# EasyEDA Pro project DC电路板.eprj

# Schematic Schematic1
Create Date: 2023-11-20; Page Name: P1; Project Name: DC电路板; Schematic Name: Schematic1; Update Date: 2023-11-20; Company: 嘉立创EDA; Page Size: A4; Version: V1.0
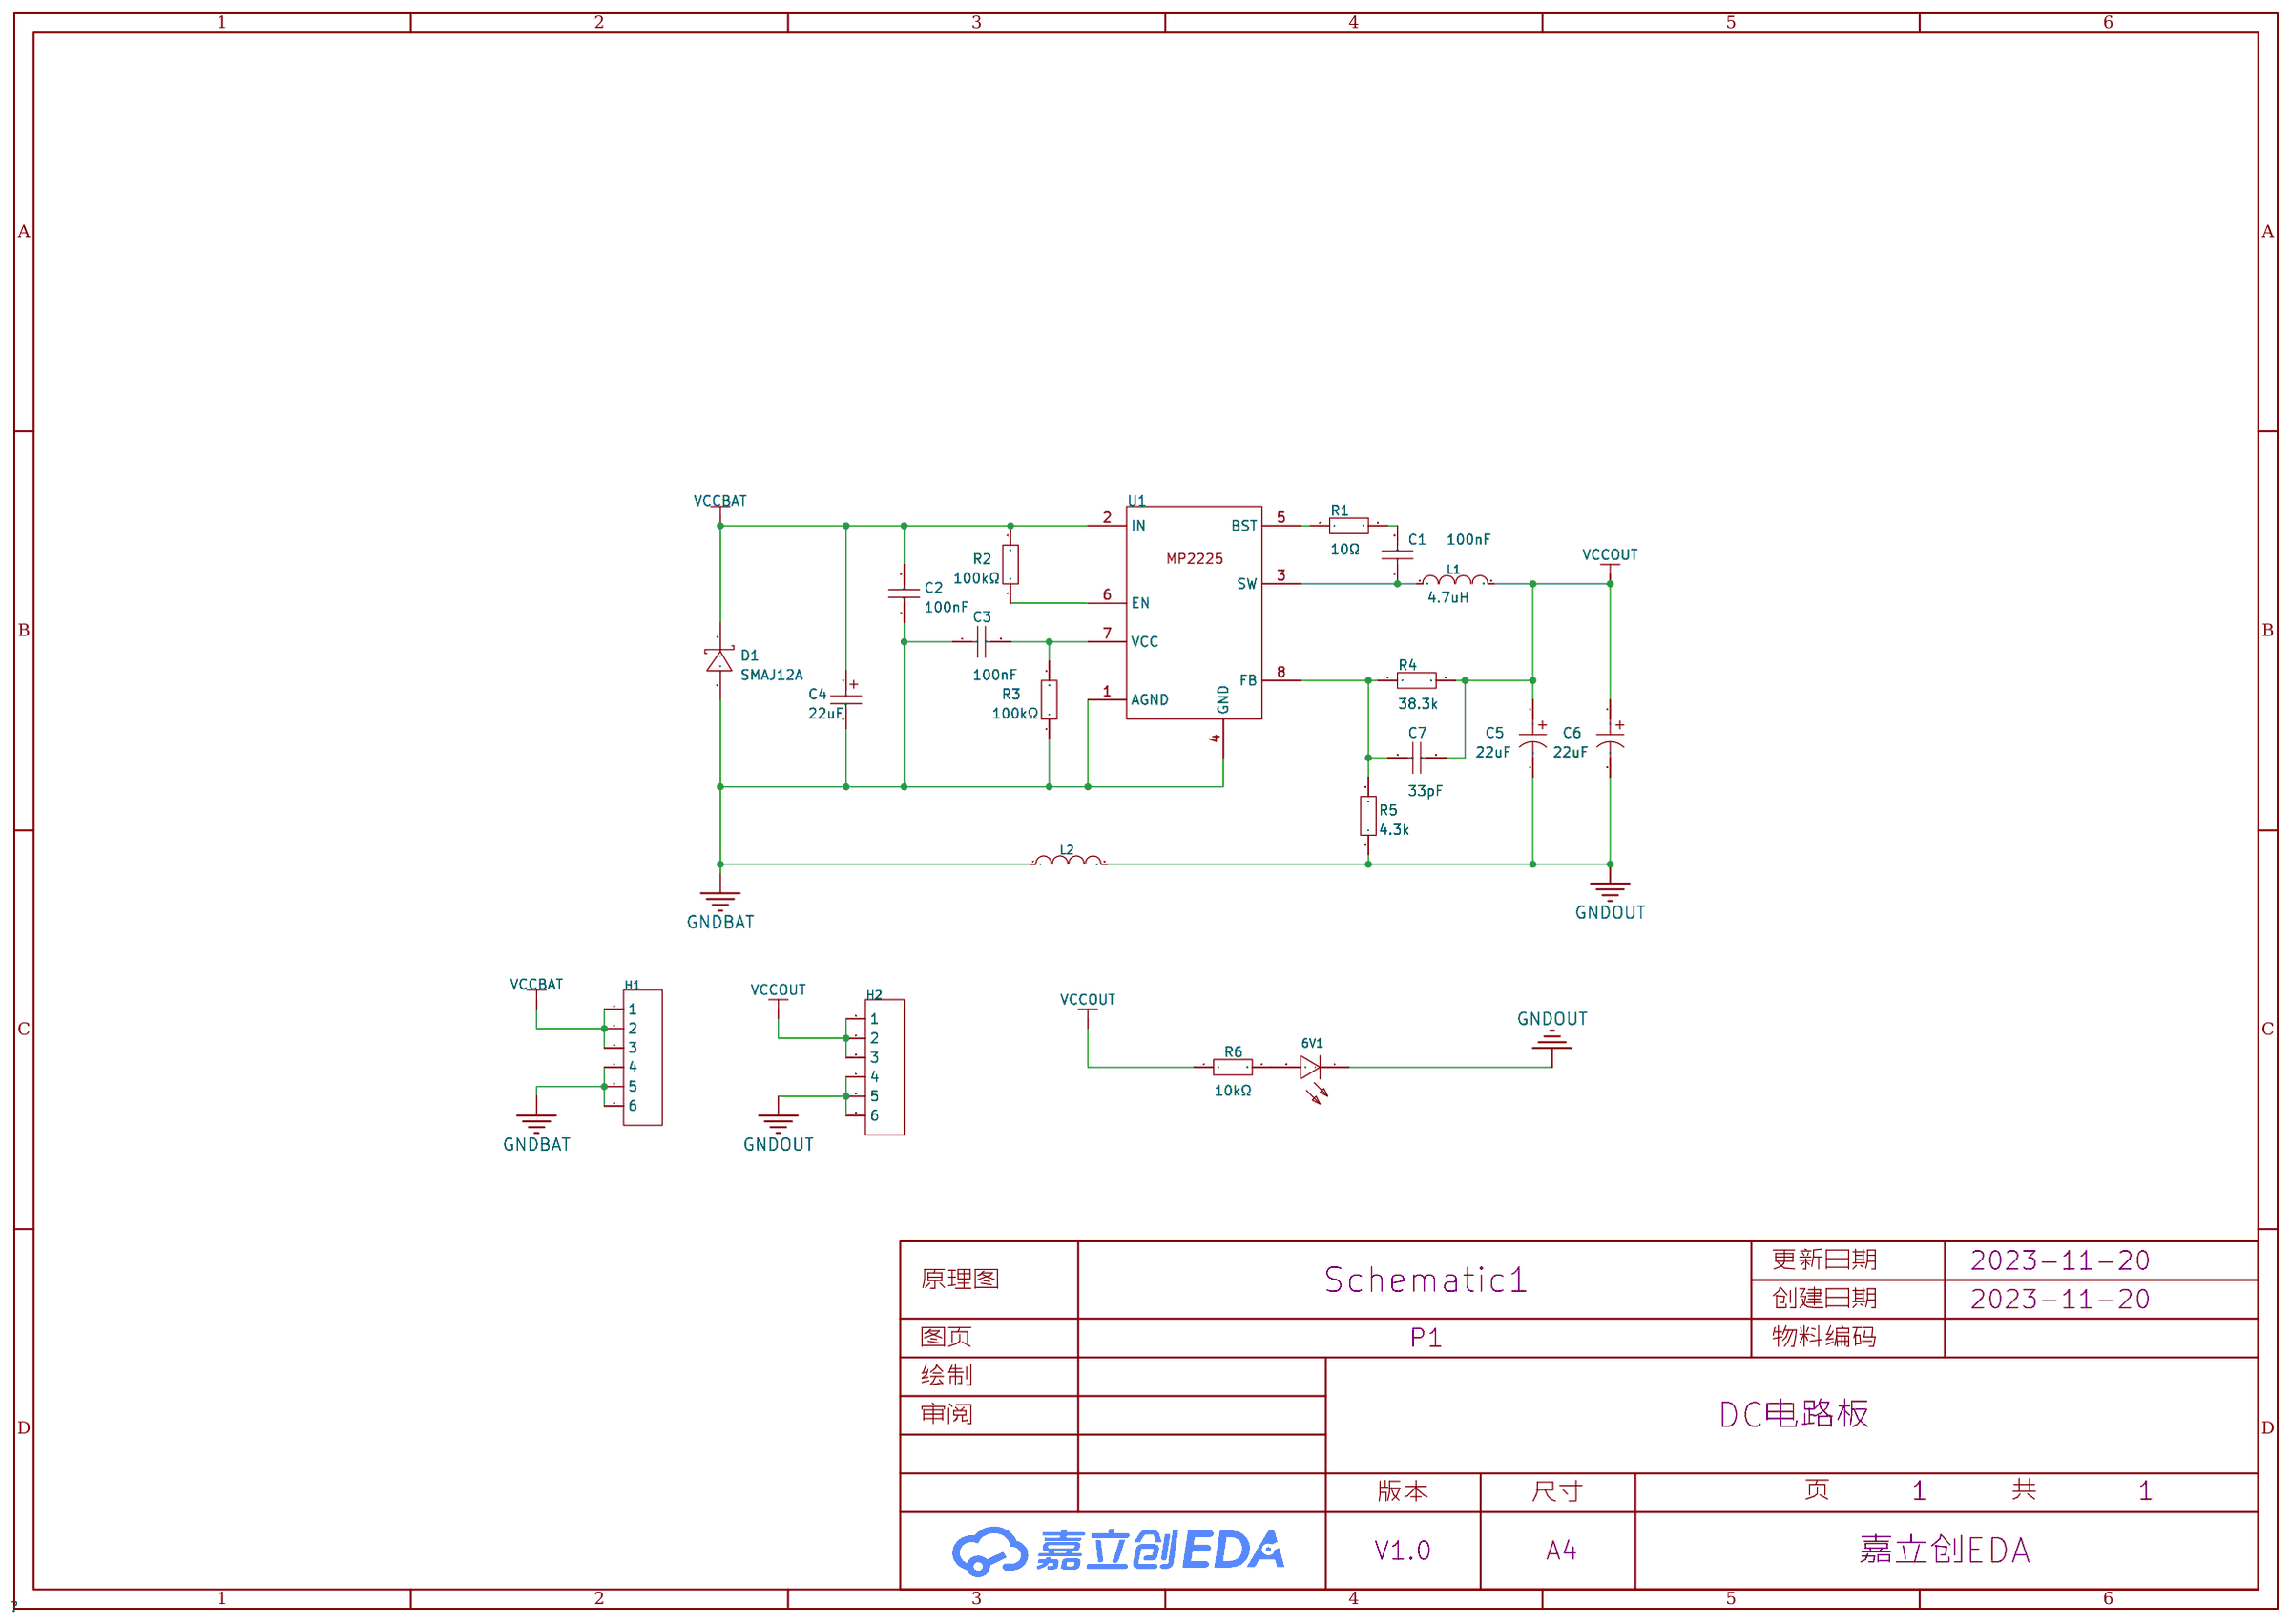
[diagram p0: schematic sheet]

## Parts
6V1  NCD0603W1  [LED0603-RD]
C1  100nF  [C0603]
C2  100nF  [C0603]
C3  100nF  [C0603]
C4  22uF  [CAP-SMD_L6.0-W3.2-R-RD]
C5  22uF  [CAP-SMD_L3.2-W1.6]
C6  22uF  [CAP-SMD_L3.2-W1.6]
C7  33pF  [C0603]
D1  SMAJ12A  [SMA_L4.4-W2.7-LS5.1-RD]
H1  -  [HDR-TH_6P-P2.54-V-M-1]
H2  -  [HDR-TH_6P-P2.54-V-M-1]
L1  4.7uH  [IND-SMD_L5.4-W5.2_FXL0530]
L2  CBG201209U000T  [L0805]
R1  10Ω  [R0603]
R2  100kΩ  [R0603]
R3  100kΩ  [R0603]
R4  38.3k  [R0603]
R5  4.3k  [R0603]
R6  10kΩ  [R0603]
U1  -  [tsot-23-8_l2.9-w1.6-p0.65-ls2.8-br]

## Library data of the parts
6V1 = NCD0603W1: 发光颜色:白灯;; LCSC Part Name: 白灯 0603白灯   正贴; Supplier Part: C84265; Manufacturer: 国星光电; Supplier Footprint: 0603; JLCPCB Part Class: Extended Part; Datasheet: https://atta.szlcsc.com/upload/public/pdf/source/20200820/C84265_479E6193713348A548E5CD6D9278BF16.pdf; Supplier: LCSC; Emitted Color: 白灯
C1-C3 = 0603B104K500NT: 容值:100nF;精度:±10%;额定电压:50V;材质(温度系数):X7R;; LCSC Part Name: 100nF ±10% 50V; Supplier Part: C30926; Manufacturer: FH(风华); Supplier Footprint: 0603; JLCPCB Part Class: Extended Part; Datasheet: https://atta.szlcsc.com/upload/public/pdf/source/20170923/C30926_1506149436298988724.pdf; Supplier: LCSC; Tolerance: ±10%; Voltage Rated: 50V; Temperature Coefficient: X7R
C4 = TAJC226K025RNJ: 容值:22uF;精度:±10%;额定电压:25V;等效串联电阻:1.4Ω@100kHz;; LCSC Part Name: 22uF ±10% 25V; Supplier Part: C7214; Manufacturer: Kyocera AVX; Supplier Footprint: CASE-C-6032; JLCPCB Part Class: Extended Part; Datasheet: https://atta.szlcsc.com/upload/public/pdf/source/20160107/1457707749198.pdf; Supplier: LCSC; Tolerance: ±10%; Rated Voltage: 25V; Equivalent Series Resistance(ESR): 1.4Ω@100kHz; Operating Temperature: -55℃~+125℃
C5 C6 = CA45-A-16V-22uF-K: 容值:22uF;精度:±10%;额定电压:16V;等效串联电阻:6Ω@100kHz;; LCSC Part Name: 22uF ±10% 16V; Supplier Part: C782264; Manufacturer: CEC(振华新云); Supplier Footprint: CASE-A-3216; JLCPCB Part Class: Extended Part; Datasheet: https://atta.szlcsc.com/upload/public/pdf/source/20200909/C782264_D6D9C4EF3B25E81633C26A9294FBB820.pdf; Supplier: LCSC; Tolerance: ±10%; Rated Voltage: 16V; Equivalent Series Resistance(ESR): 6Ω@100kHz; Operating Temperature: -55℃~+125℃
C7 = CL10C330JB8NNNC: 容值:33pF;精度:±5%;额定电压:50V;材质(温度系数):C0G;; LCSC Part Name: 33pF ±5% 50V; Supplier Part: C1663; Manufacturer: SAMSUNG(三星); Supplier Footprint: 0603; JLCPCB Part Class: 基础库; Datasheet: https://atta.szlcsc.com/upload/public/pdf/source/20160103/1457707688366.pdf; Supplier: LCSC; Tolerance: ±5%; Voltage Rated: 50V; Temperature Coefficient: C0G
D1 = SMAJ12A_C152123: 极性:单向;反向截止电压(Vrwm):12V;击穿电压:13.3V;峰值脉冲电流(Ipp)@10/1000μs:20.1A;最大钳位电压:19.9V;; LCSC Part Name: 单向 Vrwm:12V; Supplier Part: C152123; Manufacturer: BORN(伯恩半导体); Supplier Footprint: SMA(DO-214AC); JLCPCB Part Class: 扩展库; Datasheet: https://atta.szlcsc.com/upload/public/pdf/source/20181205/C152123_F062F647BF686681D55A64EEC7CBEC59.pdf; Supplier: LCSC; Polarity: 单向; Reverse Stand-Off Voltage (Vrwm): 12V; Breakdown Voltage: 13.3V; Peak Pulse Current (Ipp)@10/1000μs: 20.1A; Maximum Clamping Voltage: 19.9V
H1 H2 = HDR-M_2.54_1x6P: Supplier Part: C37208; Supplier Footprint: 插件
L1 = FXL0530-4R7-M: 电感值:4.7uH;精度:±20%;额定电流:4.5A;饱和电流(Isat):5A;; LCSC Part Name: 4.7uH ±20% 4.5A 50mΩ; Supplier Part: C177246; Manufacturer: cjiang(长江微电); Supplier Footprint: SMD,5.4x5.2x2.8mm; JLCPCB Part Class: Extended Part; Supplier: LCSC; Tolerance: ±20%; Rated Current: 4.5A; Saturation Current (Isat): 5A; DC Resistance (DCR): 50mΩ
L2 = CBG201209U000T: 标称阻抗@测试频率:0Ω@100MHz;直流电阻(RDC):80mΩ;; LCSC Part Name: 单路 0805磁珠 阻抗0Ω@100MHz; Supplier Part: C91037; Manufacturer: FH(风华); Supplier Footprint: 0805; JLCPCB Part Class: 扩展库; Datasheet: https://atta.szlcsc.com/upload/public/pdf/source/20161217/1481939213023.pdf; Supplier: LCSC; Impedance @ Frequency: 0Ω@100MHz; DC Resistance: 80mΩ; Current Rating: 900mA; Circuits: 1
R1 = 0603WAF100JT5E: 电阻类型:厚膜电阻;阻值:10Ω;精度:±1%;功率:100mW;; LCSC Part Name: 10Ω ±1% 100mW; Supplier Part: C22859; Manufacturer: UNI-ROYAL(厚声); Supplier Footprint: 0603; JLCPCB Part Class: Basic Part; Datasheet: https://atta.szlcsc.com/upload/public/pdf/source/20200306/C422600_1E6D84923E4A46A82E41ADD87F860B5C.pdf; Supplier: LCSC; Type: 厚膜电阻; Tolerance: ±1%; Power(Watts): 100mW; Temperature Coefficient: ±400ppm/℃; Overload Voltage (Max): 75V; Operating Temperature Range: -55℃~+155℃
R2 R3 = RC0603FR-07100KL: 电阻类型:厚膜电阻;阻值:100kΩ;精度:±1%;功率:100mW;; LCSC Part Name: 100kΩ ±1% 100mW; Supplier Part: C14675; Manufacturer: YAGEO(国巨); Supplier Footprint: 0603; JLCPCB Part Class: Extended Part; Datasheet: https://atta.szlcsc.com/upload/public/pdf/source/20140324/1457707028752.pdf; Supplier: LCSC; Type: 厚膜电阻; Tolerance: ±1%; Power(Watts): 100mW; Temperature Coefficient: ±100ppm/℃; Overload Voltage (Max): 75V; Operating Temperature Range: -55℃~+155℃
R4 = 0603WAF4022T5E: 电阻类型:厚膜电阻;阻值:40.2kΩ;精度:±1%;功率:100mW;; LCSC Part Name: 40.2kΩ ±1% 100mW; Supplier Part: C12447; Manufacturer: UNI-ROYAL(厚声); Supplier Footprint: 0603; JLCPCB Part Class: Basic Part; Datasheet: https://atta.szlcsc.com/upload/public/pdf/source/20200306/C422600_1E6D84923E4A46A82E41ADD87F860B5C.pdf; Supplier: LCSC; Type: 厚膜电阻; Tolerance: ±1%; Power(Watts): 100mW; Temperature Coefficient: ±100ppm/℃; Overload Voltage (Max): 75V; Operating Temperature Range: -55℃~+155℃
R5 = 0603WAF5491T5E: 电阻类型:厚膜电阻;阻值:5.49kΩ;精度:±1%;功率:100mW;; LCSC Part Name: 5.49kΩ ±1% 100mW; Supplier Part: C23069; Manufacturer: UNI-ROYAL(厚声); Supplier Footprint: 0603; JLCPCB Part Class: Extended Part; Datasheet: https://atta.szlcsc.com/upload/public/pdf/source/20200306/C422600_1E6D84923E4A46A82E41ADD87F860B5C.pdf; Supplier: LCSC; Type: 厚膜电阻; Tolerance: ±1%; Power(Watts): 100mW; Temperature Coefficient: ±100ppm/℃; Overload Voltage (Max): 75V; Operating Temperature Range: -55℃~+155℃
R6 = 0603WAF1002T5E: 电阻类型:厚膜电阻;阻值:10kΩ;精度:±1%;功率:100mW;; LCSC Part Name: 厚膜电阻 10kΩ ±1% 100mW; Supplier Part: C25804; Manufacturer: UNI-ROYAL(厚声); Supplier Footprint: 0603; JLCPCB Part Class: 基础库; Datasheet: https://atta.szlcsc.com/upload/public/pdf/source/20200306/C422600_1E6D84923E4A46A82E41ADD87F860B5C.pdf; Supplier: LCSC; Type: 厚膜电阻; Tolerance: ±1%; Power(Watts): 100mW; Temperature Coefficient: ±100ppm/℃; Overload Voltage (Max): 75V; Operating Temperature Range: -55℃~+155℃
U1 = MP2225: DC-DC芯片

## Nets
GNDBAT: C2.1 C3.2 C4.2 D1.2(A) H1.4 H1.5 H1.6 L2.1 R3.1 U1.1(AGND) U1.4(GND)
GNDOUT: 6V1.1(-) C5.2 C6.2 H2.4 H2.5 H2.6 L2.2 R5.1
VCCBAT: C2.2 C4.1 D1.1(K) H1.1 H1.2 H1.3 R2.2 U1.2(IN)
VCCOUT: C5.1 C6.1 C7.1 H2.1 H2.2 H2.3 L1.2 R4.1 R6.1
$1N712: C1.1 L1.1 U1.3(SW)
$1N716: 6V1.2(+) R6.2
$1N718: R2.1 U1.6(EN)
$1N720: C3.1 R3.2 U1.7(VCC)
$1N722: C7.2 R4.2 R5.2 U1.8(FB)
$1N723: C1.2 R1.2
$1N724: R1.1 U1.5(BST)

# Board PCB1
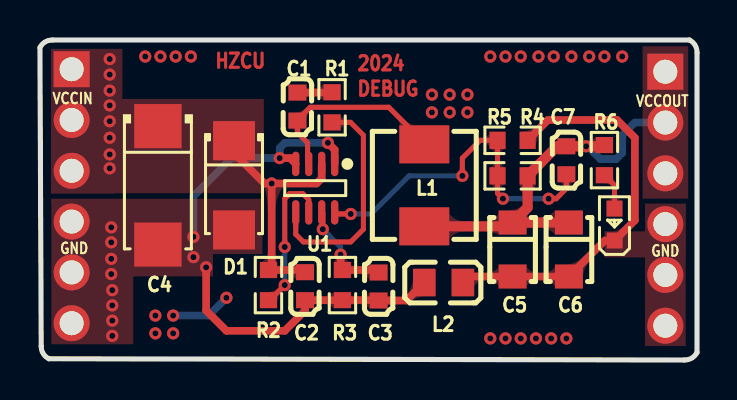
[diagram p1: board, top side]
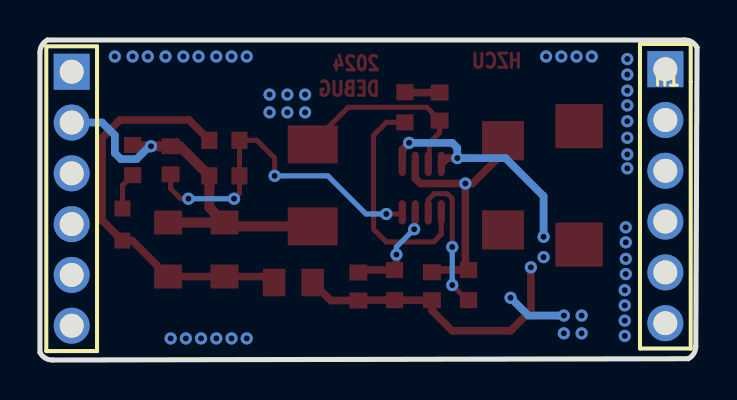
[diagram p2: board, bottom side, seen from below]

Outline 32.89 x 16 mm; copper layers: Top Layer, Bottom Layer. Coordinates in mm from the lower left corner of the outline.
Outline path: 0,15.62 0.06,0.7 arc(0.16,0.33) 0.44,0.06 32.26,0 arc(32.63,0.1) 32.89,0.38 32.89,15.37 arc(32.8,15.74) 32.51,16 0.63,16 arc(0.26,15.9) 0,15.62
Stack: Top Layer 0.035mm / Dielectric1 1.51mm FR4 er 4.5 / Bottom Layer 0.035mm

## Design rules (mm)
template: JLCPCB Capability(Two Layers Board)
spacing copperThickness1oz (default): track to track 0.102, other pairs 0.152 to 0.3
spacing copperThickness2oz: track to track 0.203, other pairs 0.152 to 0.3
track width copperThickness1oz (default): min 0.127, default 0.254, max 2.54
track width copperThickness2oz: min 0.203, default 0.254, max 2.54
differential pair differentialPair (default): width min 0.127, default 0.254, max 2.54; gap min 0.152, default 0.152
via viaSize (default): diameter min 0.5, default 0.61, max 10; hole min 0.3, default 0.305, max 6.3

## Placement (name value [footprint] x y rotation side)
6V1  NCD0603W1  [LED0603-RD]  28.77 6.77 90 top
C1  100nF  [C0603]  12.89 12.67 90 top
C2  100nF  [C0603]  13.27 3.69 90 top
C3  100nF  [C0603]  16.95 3.68 270 top
C4  22uF  [CAP-SMD_L6.0-W3.2-R-RD]  5.91 8.73 90 top
C5  22uF  [CAP-SMD_L3.2-W1.6]  23.66 5.52 270 top
C6  22uF  [CAP-SMD_L3.2-W1.6]  26.48 5.52 270 top
C7  33pF  [C0603]  26.35 9.99 270 top
D1  SMAJ12A  [SMA_L4.4-W2.7-LS5.1-RD]  9.72 8.73 270 top
H1  -  [HDR-TH_6P-P2.54-V-M-1]  1.59 8.19 270 bottom
H2  -  [HDR-TH_6P-P2.54-V-M-1]  31.31 8.06 270 bottom
L1  4.7uH  [IND-SMD_L5.4-W5.2_FXL0530]  19.24 8.73 270 top
L2  CBG201209U000T  [L0805]  20.21 3.87 0 top
R1  10Ω  [R0603]  14.62 12.64 90 top
R2  100kΩ  [R0603]  11.44 3.75 90 top
R3  100kΩ  [R0603]  15.14 3.75 90 top
R4  38.3k  [R0603]  23.66 9.21 180 top
R5  4.3k  [R0603]  23.66 10.99 180 top
R6  10kΩ  [R0603]  28.26 10 270 top
U1  -  [tsot-23-8_l2.9-w1.6-p0.65-ls2.8-br]  13.78 8.59 90 top

## Footprints (pads in the part's own frame, mm; a bottom-side part is the same pattern mirrored in y, then rotated)
C0603
  rect 0.8x0.9 smd: 1(-0.7,0) 2(0.7,0)
CAP-SMD_L3.2-W1.6
  rect 1.2x1.4 smd: 1(-1.35,0) 2(1.35,0)
CAP-SMD_L6.0-W3.2-R-RD
  rect 2.208x2.376 smd: 1(2.961,0) 2(-2.961,0)
HDR-TH_6P-P2.54-V-M-1
  rect 1.8x1.8 hole 1.2: 1(-6.35,0)
  round 1.8 hole 1.2: 2(-3.81,0) 3(-1.27,0) 4(1.27,0) 5(3.81,0) 6(6.35,0)
IND-SMD_L5.4-W5.2_FXL0530
  rect 1.9x2.5 smd: 1(-2.05,0) 2(2.05,0)
L0805
  rect 1.133x1.377 smd: 1(-0.966,0) 2(0.966,0)
LED0603-RD
  rect 0.8x0.8 smd: 1(-0.799,-0.004) 2(0.799,0.004)
R0603
  rect 0.806x0.864 smd: 1(-0.753,0) 2(0.753,0)
SMA_L4.4-W2.7-LS5.1-RD
  rect 1.96x2.1 smd: 1(-2.23,0) 2(2.23,0)
tsot-23-8_l2.9-w1.6-p0.65-ls2.8-br
  oval 1.222x0.364 smd: 1(1.211,-0.975) 2(1.211,-0.325) 3(1.211,0.325) 4(1.211,0.975) 5(-1.211,0.975) 6(-1.211,0.325) 7(-1.211,-0.325) 8(-1.211,-0.975)

## Nets
As in the schematic.

## Via types
v1: diameter 0.61, hole 0.305, Top Layer to Bottom Layer, 61 vias

## Routing (per net, layer and track width the routed paths; a pad name or vN(x,y) marks a point on that pad's centre or on a via; arc(x,y) is an arc through that point)
GNDBAT: length 27.1
  Top Layer w0.381: v1(14.41,10.86) 14.75,10.52 U1.1 ; U1.4 12.51,10.1 v1(12,10.1) ; v1(8.32,4.64) 8.32,2.48 9.33,1.46 12.26,1.46 13.27,2.48 C2.1 15.14,2.99 R3.1 16.94,2.99 C3.2 18.34,2.98 L2.1
  Bottom Layer w0.381: v1(7.68,6.16) 7.68,8.19 9.59,10.1 v1(12,10.1) 12,10.6 12.26,10.86 v1(14.41,10.86)
  vias: v1(3.57,6.63) v1(3.57,5.88) v1(3.57,5.06) v1(3.57,4.3) v1(3.62,3.49) v1(3.62,2.73) v1(3.62,1.97) v1(3.62,1.21) v1(7.68,5.14)
GNDOUT: length 23.2
  Top Layer w0.381: R5.1 25.43,12 28.89,12 29.78,11.11 29.78,6.99 6V1.1 28.28,5.97 C6.2 C5.2 21.47,4.17 L2.2
  Bottom Layer w0.381: v1(9.33,3.11) 8.45,2.22 v1(6.67,2.22)
  vias: v1(5.27,15.18) v1(5.78,2.22) v1(5.78,1.33) v1(6.03,15.18) v1(6.67,1.33) v1(6.79,15.18) v1(7.56,15.18) v1(19.62,13.27) v1(19.62,12.38) v1(20.51,13.27) v1(20.51,12.38) v1(21.4,13.27) v1(21.4,12.38) v1(22.54,15.18) v1(22.54,1.08) v1(23.3,15.18) v1(23.3,1.08) v1(24.07,15.18) v1(24.07,1.08) v1(24.83,1.08) v1(24.96,15.18) v1(25.59,1.08) v1(25.72,15.18) v1(26.35,1.08) v1(26.61,15.18) v1(27.5,15.18) v1(28.26,15.18) v1(29.15,15.18)
VCCBAT: length 12.7
  Top Layer w0.381: D1.1 9.72,10.35 11.24,8.83 v1(11.6,8.83) ; v1(11.6,8.83) 11.6,4.66 R2.2 13.16,4.5 C2.2 ; v1(11.6,8.83) 13.85,8.83 14.1,9.08 U1.2
  vias: v1(3.49,15.05) v1(3.49,14.27) v1(3.49,13.47) v1(3.49,12.73) v1(3.49,11.94) v1(3.49,11.11) v1(3.49,10.28) v1(3.49,9.59)
VCCOUT: length 20
  Top Layer w0.508: 19.24,6.68 23.47,6.68 C5.1 ; C5.1 24.41,7.63 R4.1 25.89,10.69 C7.1 v1(27.34,10.69) 28.2,10.69 R6.1 ; C5.1 C6.1
  Bottom Layer w0.381: H2.2 29.78,11.87 29.15,11.24 29.15,10.35 28.84,10.05 28.05,10.05 27.41,10.69 v1(27.34,10.69)
$1N712: length 9.9
  Top Layer w0.254: L1.1 19.24,10.86 17.46,12.64 13.53,12.64 12.89,12 C1.1 12.89,11.37 13.4,10.86 13.4,9.86 U1.3
$1N716: length 1.9
  Top Layer w0.254: R6.2 28.76,8.74 6V1.2
$1N718: length 7.5
  Top Layer w0.254: U1.6 13.45,8.02 13.16,8.32 12.51,8.32 12.26,8.06 v1(12.26,5.65) ; R2.1 11.5,2.99 v1(12.26,3.75)
  Bottom Layer w0.254: v1(12.26,3.75) v1(12.26,5.65)
$1N720: length 5.2
  Top Layer w0.254: U1.7 14.16,7.33 v1(14.16,6.54)
  Top Layer w0.381: C3.1 16.83,4.5 R3.2 15.05,4.59 v1(15.05,5.27)
  Bottom Layer w0.254: v1(15.05,5.27) 15.05,5.65 v1(14.16,6.54)
$1N722: length 17.4
  Top Layer w0.254: U1.8 14.84,7.3 v1(15.56,7.3) ; v1(23.18,8.06) 22.91,8.34 R4.2 R5.2 22.03,10.99 21.15,10.1 v1(21.15,9.21) ; v1(25.46,8.06) 25.84,8.06 26.35,8.57 C7.2
  Bottom Layer w0.254: v1(15.56,7.3) 16.57,7.3 18.48,9.21 v1(21.15,9.21) ; v1(23.18,8.06) v1(25.46,8.06)
$1N723: length 1.7
  Top Layer w0.381: 12.89,13.37 14.61,13.37 R1.2
$1N724: length 11.4
  Top Layer w0.254: R1.1 15.55,11.88 16.19,11.24 16.19,6.54 15.56,5.91 13.19,5.91 12.8,6.29 U1.5

## Copper pours and planes (outline as drawn; the poured copper is in the pictures)
GNDBAT on Top Layer: 0.55,8.06 11.14,8.06 11.14,0.78 0.55,0.78
GNDOUT on Top Layer: 28.26,7.81 32.32,7.81 32.32,5.13 28.26,5.13
GNDOUT on Top Layer: 30.29,7.81 32.32,7.81 32.32,0.7 30.29,0.7
GNDOUT on Top Layer: -1.84,17.97 34.99,17.97 34.99,-2.48 -1.84,-2.48
GNDOUT on Bottom Layer: -1.84,17.97 34.99,17.97 34.99,-2.48 -1.84,-2.48
VCCBAT on Top Layer: 0.55,15.56 11.21,15.56 11.21,8.32 0.55,8.32
VCCOUT on Top Layer: 30.16,15.68 32.45,15.68 32.45,8.06 30.16,8.06

Small or netless copper shapes (teardrops, artwork), in the pictures only: 62 on Top Layer, 16 on Bottom Layer

## Text on the board
Top Layer: HZCU | 2024 | DEBUG
Top Silkscreen Layer: VCCIN | GND | VCCOUT
